# Altium schematic sheet Buzzer.SchDoc: Buzzer
size A4; SheetNumber: 7; SheetTotal: 10
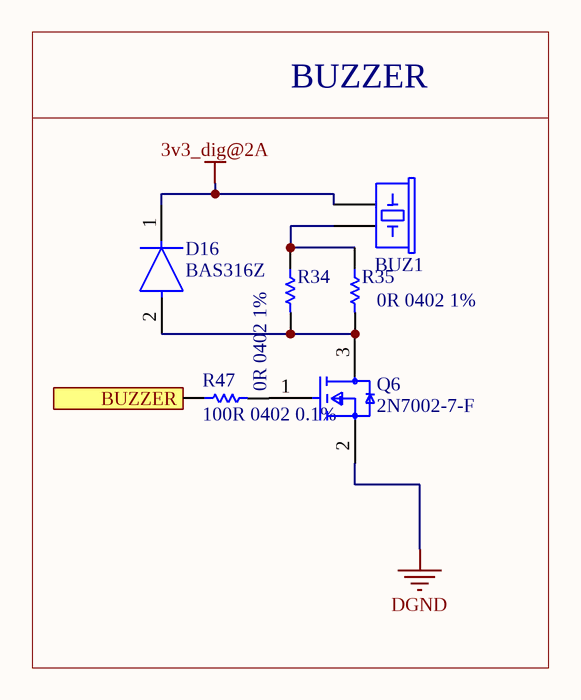
[diagram p0: Buzzer.SchDoc]

## Parts
BUZ1  CUI CMT-1285C-035  [BUZZER-12MM-NS]  (value not drawn)
D16  BAS316Z  [FP-SOD323-IPC_B]
Q6  2N7002-7-F  [FP-SOT23-MFG]
R34  0R 0402 1%  [RESC1005X40X25ML05T10]
R35  0R 0402 1%  [RESC1005X40X25ML05T10]
R47  100R 0402 0.1%  [RESC1005X40X25ML05T10]

## Blocks framed on the sheet
BUZZER: BUZ1 D16 Q6 R34 R35 R47

## Ports
BUZZER (in)

## Nets
3v3_dig@2A: BUZ1.1(+) D16.1(C)
DGND: Q6.2(S)
BUZZER: R47.1 ; port BUZZER
NetBUZ1_2: BUZ1.2(-) R34.1 R35.1
NetD16_2: D16.2(A) Q6.3(D) R34.2 R35.2
NetQ6_1: Q6.1(G) R47.2

## Notes on the sheet
- Title
- Size:
- Date:
- A3
- Author:
- Time:
- Revision:
- Sheet
- of
- File:

## Library data of the parts
BUZ1 = CMP-581a9557be5887dd-1: Audio Buzzer Magnetic 3Vo-p 5Vo-p 70mA 3.5Vo-p 85dB Through Hole Pin Tray; Lead-Free Status: Lead Free; Octopart URL: https://octopart.com/cmt-1285c-035-cui-71811876; Manufacturer Part Number: CMT-1285C-035; Mounting Style: Through Hole; RoHS: Compliant; OctopartID: 581a9557be5887dd; Manufacturer Part Number 2: GMC1205YA-16R2048; LCSC_PN: C252915
D16 = CMP-14399-000022-1: DIODE GEN PURP 100V 250MA SC76-2; RoHS Compliant: Yes; LCSC_PN: C549222
Q6 = CMP-2000-04929-2: MOSFET N-CH 60V 115MA SOT23-3; Turn-On Delay Time: 7ns; Turn-Off Delay Time: 11ns; Drain to Source Resistance: 7.5R; Rise Time: 3ns; Drain to Source Breakdown Voltage: 70V; Input Capacitance: 50pF; Number of Elements: 1; Power Dissipation: 540mW; Max Power Dissipation: 300mW; Fall Time: 5.6ns; Gate to Source Voltage (Vgs): 20V; Threshold Voltage: 2.5V; Element Configuration: Single; Termination: SMD/SMT; Weight: 0.000282oz; Radiation Hardening: No; Max Operating Temperature: 150°C; On-State Resistance: 7.5R; Mount: Surface Mount; Current Rating: 115mA; Contact Plating: Tin; Lead Free: Lead Free; Min Operating Temperature: -55°C; Number of Pins: 3; REACH SVHC: No SVHC; Drain to Source Voltage (Vdss): 60V; Width: 1.3mm; Package Quantity: 3000; Length: 2.9mm; Case/Package: SOT-23; Number of Channels: 1; Dual Supply Voltage: 60V; Packaging: Tape and Reel; Height: 1mm; Voltage Rating (DC): 60V; Nominal Vgs: 2.5V; Continuous Drain Current (ID): 115mA; Voltage: 60V; Rds On Max: 7.5R; LCSC_PN: C65189
R34 R35 R47 = CMP-2002-07472-1
  R34 R35: LCSC_PN: C60485
  R47: LCSC_PN: C106233